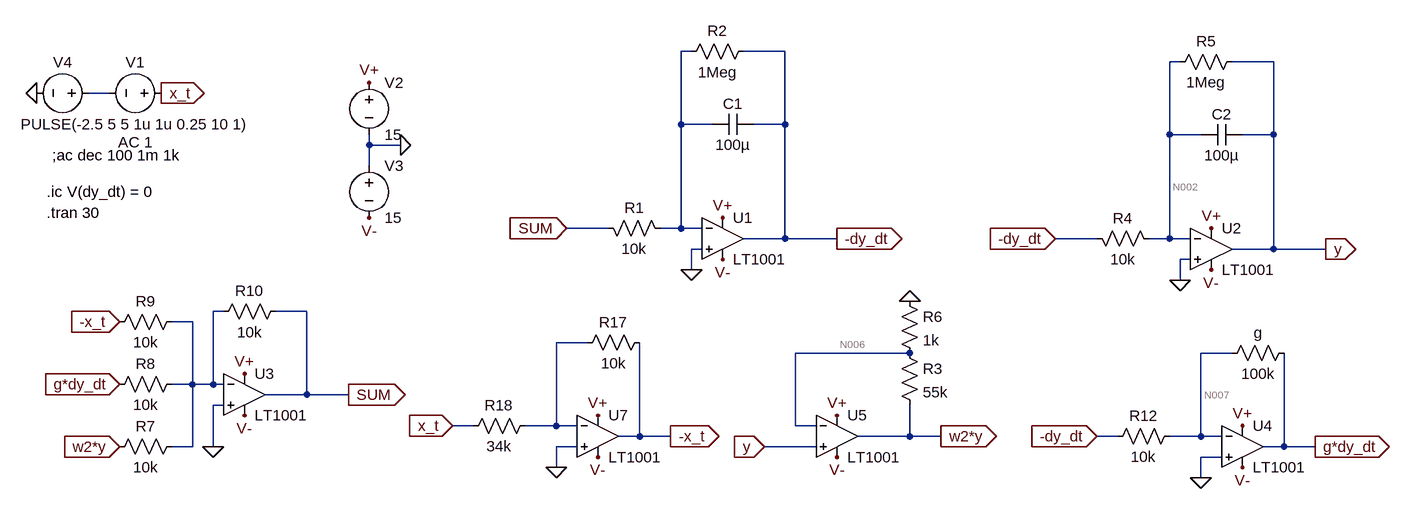
[diagram p0: schematic Analogue_Computer_FINAL.asc]
Analogue_Computer_FINAL.asc, the LTspice schematic file:
Version 4
SHEET 1 1932 1080
WIRE 32 -352 16 -352
WIRE 176 -352 112 -352
WIRE 784 -336 768 -336
WIRE 928 -336 864 -336
WIRE -864 -288 -896 -288
WIRE 16 -240 16 -352
WIRE 64 -240 16 -240
WIRE 176 -240 176 -352
WIRE 176 -240 128 -240
WIRE 768 -224 768 -336
WIRE 816 -224 768 -224
WIRE 928 -224 928 -336
WIRE 928 -224 880 -224
WIRE -464 -208 -464 -224
WIRE -416 -208 -464 -208
WIRE -464 -176 -464 -208
WIRE -96 -80 -160 -80
WIRE 16 -80 16 -240
WIRE 16 -80 -16 -80
WIRE 48 -80 16 -80
WIRE 176 -64 176 -240
WIRE 176 -64 112 -64
WIRE 256 -64 176 -64
WIRE 656 -64 592 -64
WIRE 768 -64 768 -224
WIRE 768 -64 736 -64
WIRE 800 -64 768 -64
WIRE 48 -48 32 -48
WIRE 928 -48 928 -224
WIRE 928 -48 864 -48
WIRE 1008 -48 928 -48
WIRE 800 -32 784 -32
WIRE 32 -16 32 -48
WIRE 784 0 784 -32
WIRE -688 48 -704 48
WIRE -560 48 -608 48
WIRE -736 64 -768 64
WIRE -128 96 -176 96
WIRE 368 112 192 112
WIRE 864 112 816 112
WIRE -736 160 -736 64
WIRE -736 160 -768 160
WIRE -704 160 -704 48
WIRE -704 160 -736 160
WIRE -688 160 -704 160
WIRE -560 176 -560 48
WIRE -560 176 -624 176
WIRE -496 176 -560 176
WIRE -688 192 -704 192
WIRE -304 224 -336 224
WIRE -176 224 -176 96
WIRE -176 224 -224 224
WIRE -144 224 -176 224
WIRE 192 224 192 112
WIRE 224 224 192 224
WIRE -48 240 -48 96
WIRE -48 240 -80 240
WIRE 0 240 -48 240
WIRE 368 240 368 192
WIRE 368 240 288 240
WIRE 416 240 368 240
WIRE 688 240 656 240
WIRE 816 240 816 112
WIRE 816 240 768 240
WIRE 848 240 816 240
WIRE -736 256 -736 160
WIRE -736 256 -768 256
WIRE -704 256 -704 192
WIRE -144 256 -176 256
WIRE 224 256 144 256
WIRE 944 256 944 112
WIRE 944 256 912 256
WIRE 992 256 944 256
WIRE 848 272 816 272
WIRE -176 288 -176 256
WIRE 816 304 816 272
FLAG -416 -208 0
FLAG -464 -304 V+
FLAG -464 -96 V-
FLAG 80 -96 V+
FLAG 80 -32 V-
FLAG 256 -64 -dy_dt
IOPIN 256 -64 Out
FLAG -784 -288 x_t
IOPIN -784 -288 Out
FLAG 832 -80 V+
FLAG 832 -16 V-
FLAG 1008 -48 y
IOPIN 1008 -48 Out
FLAG 592 -64 -dy_dt
IOPIN 592 -64 In
FLAG -656 144 V+
FLAG -656 208 V-
FLAG -496 176 SUM
IOPIN -496 176 Out
FLAG -704 256 0
FLAG -160 -80 SUM
IOPIN -160 -80 In
FLAG 816 304 0
FLAG 656 240 -dy_dt
IOPIN 656 240 In
FLAG 992 256 g*dy_dt
IOPIN 992 256 Out
FLAG -176 288 0
FLAG -336 224 x_t
IOPIN -336 224 In
FLAG 0 240 -x_t
IOPIN 0 240 Out
FLAG -848 64 -x_t
IOPIN -848 64 In
FLAG -848 256 w2*y
IOPIN -848 256 In
FLAG -848 160 g*dy_dt
IOPIN -848 160 In
FLAG -112 208 V+
FLAG 880 224 V+
FLAG -112 272 V-
FLAG 880 288 V-
FLAG -976 -288 0
FLAG 32 -16 0
FLAG 784 0 0
FLAG 256 208 V+
FLAG 256 272 V-
FLAG 144 256 y
IOPIN 144 256 In
FLAG 368 32 0
FLAG 416 240 w2*y
IOPIN 416 240 Out
SYMBOL OpAmps\\LT1001 80 -128 R0
SYMATTR InstName U1
SYMBOL res -112 -96 M90
WINDOW 0 0 56 VBottom 2
WINDOW 3 32 56 VTop 2
SYMATTR InstName R1
SYMATTR Value 10k
SYMBOL voltage -768 -288 R90
WINDOW 0 -32 56 VBottom 2
WINDOW 3 32 56 VTop 2
WINDOW 123 60 56 VTop 2
WINDOW 39 0 0 Left 0
SYMATTR InstName V1
SYMATTR Value PULSE(-2.5 5 5 1u 1u 0.25 10 1)
SYMATTR Value2 AC 1
SYMBOL voltage -464 -320 R0
WINDOW 123 0 0 Left 0
WINDOW 39 0 0 Left 0
SYMATTR InstName V2
SYMATTR Value 15
SYMBOL voltage -464 -192 R0
WINDOW 123 0 0 Left 0
WINDOW 39 0 0 Left 0
SYMATTR InstName V3
SYMATTR Value 15
SYMBOL cap 128 -256 R90
WINDOW 0 0 32 VBottom 2
WINDOW 3 32 32 VTop 2
SYMATTR InstName C1
SYMATTR Value 100µ
SYMBOL res 128 -368 R90
WINDOW 0 0 56 VBottom 2
WINDOW 3 32 56 VTop 2
SYMATTR InstName R2
SYMATTR Value 1Meg
SYMBOL OpAmps\\LT1001 832 -112 R0
SYMATTR InstName U2
SYMBOL res 640 -80 M90
WINDOW 0 0 56 VBottom 2
WINDOW 3 32 56 VTop 2
SYMATTR InstName R4
SYMATTR Value 10k
SYMBOL cap 880 -240 R90
WINDOW 0 0 32 VBottom 2
WINDOW 3 32 32 VTop 2
SYMATTR InstName C2
SYMATTR Value 100µ
SYMBOL res 880 -352 R90
WINDOW 0 0 56 VBottom 2
WINDOW 3 32 56 VTop 2
SYMATTR InstName R5
SYMATTR Value 1Meg
SYMBOL OpAmps\\LT1001 -656 112 R0
SYMATTR InstName U3
SYMBOL res -752 240 R90
WINDOW 0 0 56 VBottom 2
WINDOW 3 32 56 VTop 2
SYMATTR InstName R7
SYMATTR Value 10k
SYMBOL res -752 144 R90
WINDOW 0 0 56 VBottom 2
WINDOW 3 32 56 VTop 2
SYMATTR InstName R8
SYMATTR Value 10k
SYMBOL res -752 48 R90
WINDOW 0 0 56 VBottom 2
WINDOW 3 32 56 VTop 2
SYMATTR InstName R9
SYMATTR Value 10k
SYMBOL res -592 32 R90
WINDOW 0 0 56 VBottom 2
WINDOW 3 32 56 VTop 2
SYMATTR InstName R10
SYMATTR Value 10k
SYMBOL OpAmps\\LT1001 880 192 R0
SYMATTR InstName U4
SYMBOL res 960 96 R90
WINDOW 0 0 56 VBottom 2
WINDOW 3 32 56 VTop 2
SYMATTR InstName g
SYMATTR Value 100k
SYMBOL res 784 224 R90
WINDOW 0 0 56 VBottom 2
WINDOW 3 32 56 VTop 2
SYMATTR InstName R12
SYMATTR Value 10k
SYMBOL OpAmps\\LT1001 -112 176 R0
SYMATTR InstName U7
SYMBOL res -32 80 R90
WINDOW 0 0 56 VBottom 2
WINDOW 3 32 56 VTop 2
SYMATTR InstName R17
SYMATTR Value 10k
SYMBOL res -208 208 R90
WINDOW 0 0 56 VBottom 2
WINDOW 3 32 56 VTop 2
SYMATTR InstName R18
SYMATTR Value 34k
SYMBOL voltage -880 -288 R90
WINDOW 0 -32 56 VBottom 2
WINDOW 3 32 56 VTop 2
WINDOW 123 0 0 Left 0
WINDOW 39 0 0 Left 0
SYMATTR InstName V4
SYMATTR Value ""
SYMBOL OpAmps\\LT1001 256 176 R0
SYMATTR InstName U5
SYMBOL res 352 96 R0
SYMATTR InstName R3
SYMATTR Value 55k
SYMBOL res 352 16 R0
SYMATTR InstName R6
SYMATTR Value 1k
TEXT -952 -192 Left 2 !;ac dec 100 1m 1k
TEXT -960 -136 Left 2 !.ic V(dy_dt) = 0
TEXT -960 -104 Left 2 !.tran 30

The netlist it stands for:
* Analogue_Computer_FINAL.asc
XU1 0 N001 V+ V- -dy_dt LT1001  ; pins In+ In- V+ V- OUT
R1 SUM N001 10k
V1 x_t N003 PULSE(-2.5 5 5 1u 1u 0.25 10 1) AC 1
V2 V+ 0 15
V3 0 V- 15
C1 -dy_dt N001 100µ
R2 -dy_dt N001 1Meg
XU2 0 N002 V+ V- y LT1001  ; pins In+ In- V+ V- OUT
R4 -dy_dt N002 10k
C2 y N002 100µ
R5 y N002 1Meg
XU3 0 N004 V+ V- SUM LT1001  ; pins In+ In- V+ V- OUT
R7 N004 w2*y 10k
R8 N004 g*dy_dt 10k
R9 N004 -x_t 10k
R10 SUM N004 10k
XU4 0 N007 V+ V- g*dy_dt LT1001  ; pins In+ In- V+ V- OUT
R§g g*dy_dt N007 100k
R12 N007 -dy_dt 10k
XU7 0 N005 V+ V- -x_t LT1001  ; pins In+ In- V+ V- OUT
R17 -x_t N005 10k
R18 N005 x_t 34k
V4 N003 0
XU5 y N006 V+ V- w2*y LT1001  ; pins In+ In- V+ V- OUT
R3 N006 w2*y 55k
R6 0 N006 1k
;ac dec 100 1m 1k
.ic V(dy_dt) = 0
.tran 30
.lib LTC.lib
.backanno
.end

* Results of the author's LTspice run, read from the files saved beside the schematic
* Operating Point, zero values left out:
*   V(v+) = 15 V
*   V(v-) = -15 V
*   V(-dy_dt) = 131.1 µV
*   V(sum) = -1.311 µV
*   V(x_t) = -2.5 V
*   V(n002) = 17.56 nV
*   V(y) = -13.11 mV
*   V(w2*y) = -734 mV
*   V(g*dy_dt) = -1.311 mV
*   V(-x_t) = 735.3 mV
*   V(n007) = -991.8 nV
*   V(n006) = -13.11 mV
*   I(R6) = 13.11 µA
*   I(R3) = 13.11 µA
*   I(R18) = 73.53 µA
*   I(R17) = 73.53 µA
*   I(R12) = -13.11 nA
*   I(G) = -13.11 nA
*   I(R10) = -131.1 pA
*   I(R9) = -73.53 µA
*   I(R8) = 131.1 nA
*   I(R7) = 73.4 µA
*   I(R5) = -13.11 nA
*   I(R4) = 13.11 nA
*   I(R2) = 131.1 pA
*   I(R1) = -131.1 pA
*   I(V4) = 73.53 µA
*   I(V3) = -13.47 mA
*   I(V2) = -13.53 mA
*   I(V1) = 73.53 µA
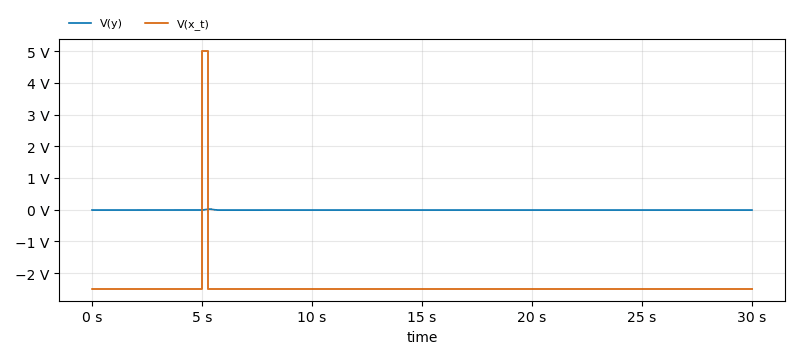
[diagram p1: Transient Analysis of Analogue_Computer_FINAL.asc, plotted from the saved traces]
* Transient Analysis, 1 run:
*   V(y): min -14.91 mV, max 16.5 mV, average -12.78 mV, rms 13.06 mV, last -13.11 mV
*   V(x_t): min -2.5 V, max 5 V, average -2.437 V, rms 2.531 V, last -2.5 V